# Altium project MIKSER_SIROVINE.PrjPcb (part 1 of 2)
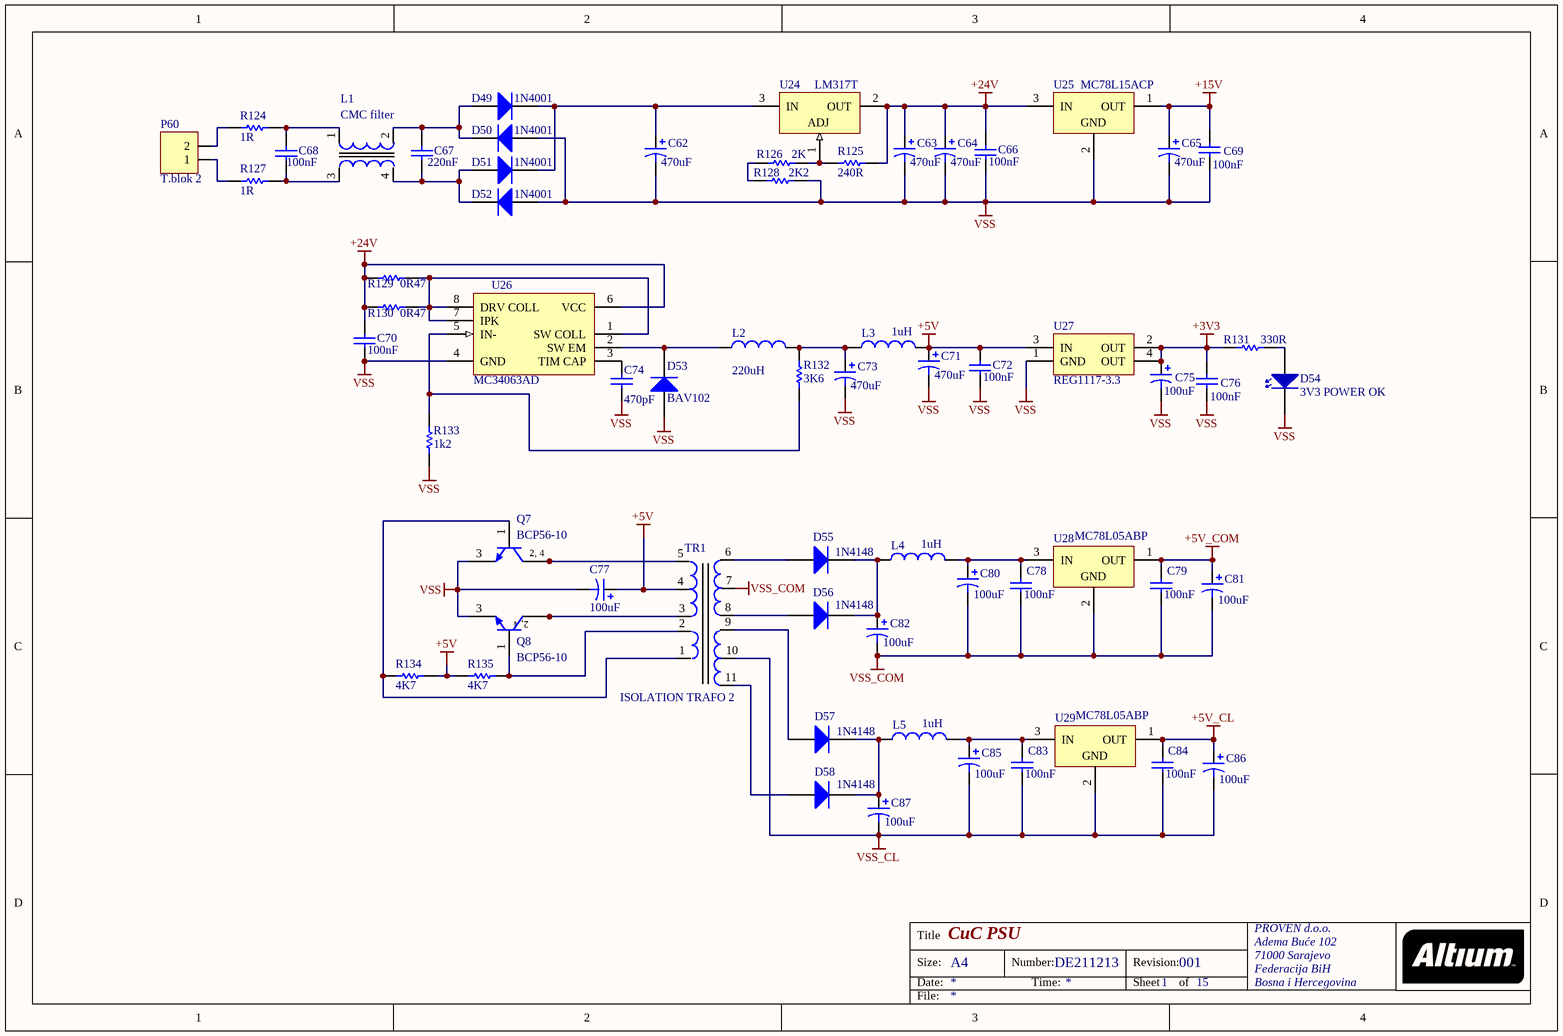
[diagram p0: CuC_PSU.SchDoc]
8 sheets, 430 parts. Net scope: global (net labels, ports and power ports of the same name join across sheets).
Board file: CuC_PCB.PcbDoc
Sheets:
  CuC_PSU.SchDoc
  CuC.SchDoc
  DigitalInput.SchDoc
  DigitalOutput.SchDoc
  RelayOutput.SchDoc
  AnalogOutput.SchDoc
  CuC_ControlComm.SchDoc
  CuC_DataComm.SchDoc

## Sheet CuC_PSU.SchDoc: CuC PSU
size A4; Author: eldar6776@hotmail.com; DrawnBy: Eldar Dedić; Organization: PROVEN d.o.o.; Address1: Adema Buće 102; Address2: 71000 Sarajevo; Address3: Federacija BiH; Address4: Bosna i Hercegovina; DocumentNumber: DE211213; Revision: 001; SheetNumber: 1; SheetTotal: 15; ProjectName: MIKSER SIROVINE

### Parts
C62  470uF  [CAPPR5-10X16]
C63  470uF  [CAPPR5-10X16]
C64  470uF  [CAPPR5-10X16]
C65  470uF  [CAPPR5-10X16]
C66  value 100nF  [1206]
C67  220nF  [VP60-3.6]
C68  100nF  [VP60-3.6]
C69  value 100nF  [1206]
C70  value 100nF  [1206]
C71  470uF  [CAPPR5-10X16]
C72  value 100nF  [1206]
C73  470uF  [CAPPR5-10X16]
C74  value 470pF  [0805]
C75  100uF  [CAPPR2-5X11]
C76  value 100nF  [1206]
C77  100uF  [CAPPR2-5X11]
C78  value 100nF  [1206]
C79  value 100nF  [1206]
C80  100uF  [CAPPR2-5X11]
C81  100uF  [CAPPR2-5X11]
C82  100uF  [CAPPR2-5X11]
C83  value 100nF  [1206]
C84  value 100nF  [1206]
C85  100uF  [CAPPR2-5X11]
C86  100uF  [CAPPR2-5X11]
C87  100uF  [CAPPR2-5X11]
D49  1N4001  [DO-41]
D50  1N4001  [DO-41]
D51  1N4001  [DO-41]
D52  1N4001  [DO-41]
D53  BAV102  [SOD80C]
D54  3V3 POWER OK  [LED 3mm]
D55  1N4148  [DO-35]
D56  1N4148  [DO-35]
D57  1N4148  [DO-35]
D58  1N4148  [DO-35]
L1  CMC filter  [MREZNI FILTER]
L2  value 220uH  [RB5-10.5]
L3  value 1uH  [RB5-10.5]
L4  value 1uH  [RB5-10.5]
L5  value 1uH  [RB5-10.5]
P60  T.blok 2  [TERMINAL BLOK 2]
Q7  BCP56-10  [SOT223_N]
Q8  BCP56-10  [SOT223_N]
R124  1R  [R6.35x2.3]
R125  240R  [ERA-0805]
R126  2K  [ERA-0805]
R127  1R  [R6.35x2.3]
R128  2K2  [ERA-0805]
R129  0R47  [RD6.35x2.3]
R130  0R47  [RD6.35x2.3]
R131  330R  [ERA-0603]
R132  3K6  [ERA-0805]
R133  1k2  [ERA-0805]
R134  4K7  [ERA-0805]
R135  4K7  [ERA-0805]
TR1  ISOLATION TRAFO 2  [ISOLATION TRAFO 2]
U24  LM317T  [221A-04]
U25  MC78L15ACP  [29-04]
U26  MC34063AD  [626-05]
U27  REG1117-3.3  [ZZ311]
U28  MC78L05ABP  [29-04]
U29  MC78L05ABP  [29-04]

### Nets
+3V3: C75.1 C76.2 R131.1 U27.2(OUT) U27.4(OUT)
+5V: C71.1 C72.2 C77.1 L3.2 R134.1 R135.2 TR1.4 U27.3(IN)
+5V_CL: C84.2 C86.1 U29.1(OUT)
+5V_COM: C79.2 C81.1 U28.1(OUT)
+15V: C65.1 C69.2 U25.1(OUT)
+24V: C63.1 C64.1 C66.2 C70.2 R125.1 R129.1 R130.1 U24.2(OUT) U25.3(IN) U26.6(VCC)
VSS: C62.2 C63.2 C64.2 C65.2 C66.1 C69.1 C70.1 C71.2 C72.1 C73.2 C74.1 C75.2 C76.1 C77.2 D50.1(A) D52.1(A) D53.1(A) D54.1 Q7.3(E) Q8.3(E) R128.1 R133.1 U25.2(GND) U26.4(GND) U27.1(GND)
VSS_CL: C83.1 C84.1 C85.2 C86.2 C87.2 TR1.10 U29.2(GND)
VSS_COM: C78.1 C79.1 C80.2 C81.2 C82.2 TR1.7 U28.2(GND)
NetC62_1: C62.1 D49.2(K) D51.2(K) U24.3(IN)
NetC67_1: C67.1 D51.1(A) D52.2(K) L1.4
NetC67_2: C67.2 D49.1(A) D50.2(K) L1.2
NetC68_1: C68.1 L1.3 R127.1
NetC68_2: C68.2 L1.1 R124.1
NetC73_1: C73.1 L2.2 L3.1 R132.2
NetC74_2: C74.2 U26.3(TIM_CAP)
NetC78_2: C78.2 C80.1 L4.2 U28.3(IN)
NetC82_1: C82.1 D55.2(K) D56.2(K) L4.1
NetC83_2: C83.2 C85.1 L5.2 U29.3(IN)
NetC87_1: C87.1 D57.2(K) D58.2(K) L5.1
NetD53_2: D53.2(K) L2.1 U26.2(SW_EM)
NetD54_2: D54.2 R131.2
NetD55_1: D55.1(A) TR1.6
NetD56_1: D56.1(A) TR1.8
NetD57_1: D57.1(A) TR1.9
NetD58_1: D58.1(A) TR1.11
NetP60_1: P60.1 R127.2
NetP60_2: P60.2 R124.2
NetQ7_1: Q7.1(B) R134.2 TR1.1
NetQ7_2: Q7.2(C) Q7.4(C) TR1.5
NetQ8_1: Q8.1(B) R135.1 TR1.2
NetQ8_2: Q8.2(C) Q8.4(C) TR1.3
NetR125_2: R125.2 R126.2 U24.1(ADJ)
NetR126_1: R126.1 R128.2
NetR129_2: R129.2 R130.2 U26.1(SW_COLL) U26.7(IPK) U26.8(DRV_COLL)
NetR132_1: R132.1 R133.2 U26.5(IN-)

### Notes on the sheet
- Title
- Size:
- Date:
- A4
- Number:
- Time:
- Revision:
- Sheet
- of
- File:
- (in symbol BCP56-10) 2, 4

### Library data of the parts
C62-C65 C71 C73 = EKA00DD347F00: Aluminum Electrolytic Capacitor, Radial Style with Long Leads: 470uF, 35V; Note: Refer to Manufacturer's Data Sheets for other lead formations; DrillSize: Nominal, Rounded To The Nearest 0.1mm; Published: 19-Mar-2004; DatasheetDocument: 20-Feb-2001; PackageReference: CAPPR5-10X16; Publisher: Altium Limited; ComponentLink1Description: Manufacturer Link; ComponentLink1URL: http://www.vishay.com/; ComponentLink2Description: Datasheet; ComponentLink2URL: http://www.vishay.com/docs/25014/eka.pdf; Value: 470uF
C66 C69 C70 C72 C76 C78 C79 C83 C84 = C1206: Ceramic Chip Capacitor - Standard; Published: 17-Jul-2002; LatestRevisionDate: 19-Mar-2004; LatestRevisionNote: Silkscreen size reduced.; DatasheetDocument: Mar-2001; PackageDocument: Mar-2001; PackageReference: 1206; Publisher: Altium Limited; Code_JEITA: 1206; Code_IPC: 3216 [1206]; ComponentLink1Description: Manufacturer Link; ComponentLink1URL: http://www.kemet.com/; ComponentLink2Description: Datasheet; ComponentLink2URL: http://www.kemet.com/kemet/web/homepage/kechome.nsf/vapubfilesname/F3102TA.pdf/$file/F3102TA.pdf
C67 C68 = VP60BA683KA: Dipped Radial Multilayer Ceramic Capacitor COG (NPO): 68nF, 50/63V; Published: 17-Dec-2003; LatestRevisionDate: 19-Mar-2004; LatestRevisionNote: PCB Footprint - Drill hole diameter reduced.; DatasheetDocument: 2-Jan-2002; PackageDocument: 2-Jan-2002; PackageReference: VP60-3.6; Publisher: Altium Limited; ComponentLink1Description: Manufacturer Link; ComponentLink1URL: http://www.vishay.com/; Value: 68nF
C74 = C0805: Ceramic Chip Capacitor - Standard; Note: Footprint corresponds to dimensions for bulk cassette packaging. This case size has tightened tolerances.; Published: 17-Jul-2002; LatestRevisionDate: 19-Mar-2004; LatestRevisionNote: Silkscreen size reduced.; DatasheetDocument: Mar-2001; PackageDocument: Mar-2001; PackageReference: 0805; Publisher: Altium Limited; Code_JEITA: 0805; Code_IPC: 2012[0805]; ComponentLink1Description: Manufacturer Link; ComponentLink1URL: http://www.kemet.com/; ComponentLink2Description: Datasheet; ComponentLink2URL: http://www.kemet.com/kemet/web/homepage/kechome.nsf/vapubfilesname/F3102TA.pdf/$file/F3102TA.pdf
C75 C77 C80-C82 C85-C87 = EKA00AA310D00: Aluminum Electrolytic Capacitor, Radial Style with Long Leads: 100uF, 16V; Note: Refer to Manufacturer's Data Sheets for other lead formations; DrillSize: Nominal, Rounded To The Nearest 0.1mm; Published: 19-Mar-2004; DatasheetDocument: 20-Feb-2001; PackageReference: CAPPR2-5X11; Publisher: Altium Limited; ComponentLink1Description: Manufacturer Link; ComponentLink1URL: http://www.vishay.com/; ComponentLink2Description: Datasheet; ComponentLink2URL: http://www.vishay.com/docs/25014/eka.pdf; Value: 100uF
D49-D52 = Diode 1N4007: 1 Amp General Purpose Rectifier; Published: 8-Jun-2000; LatestRevisionDate: 17-Jul-2002; LatestRevisionNote: Re-released for DXP Platform.; DatasheetVersion: 1998; PackageVersion: Aug-1999; PackageReference: DO-41; Publisher: Altium Limited; PackageDescription: Diode, Axial; Body 5.2 x 2.7 mm (LxDia. max), Lead Dia. 0.86 mm (max); Code_JEDEC: DO-204-AL; ComponentLink1Description: Manufacturer Link; ComponentLink1URL: http://www.fairchildsemi.com/; ComponentLink2Description: Datasheet; ComponentLink2URL: http://www.fairchildsemi.com/ds/1N%2F1N4001.pdf
D53 = BAV102: General-purpose Diode; Published: 17-Sep-2003; LatestRevisionDate: 19-Mar-2004; LatestRevisionNote: Silkscreen size reduced.; DatasheetVersion: 17-Sep-1996; PackageVersion: Jan-2002; PackageReference: SOD80C; Publisher: Altium Limited; PackageDescription: Metal Electrode Face (MELF) Diode; Body 3.5 x 1.6 mm (LxDia); ComponentLink1Description: Manufacturer Link; ComponentLink1URL: http://www.semiconductors.philips.com/; ComponentLink2Description: Datasheet; ComponentLink2URL: http://www.semiconductors.philips.com/acrobat/datasheets/BAV100_2.pdf
D54 = LED 3mm
D55-D58 = Diode 1N4148: High Conductance Fast Diode; Published: 8-Jun-2000; LatestRevisionDate: 17-Jul-2002; LatestRevisionNote: Re-released for DXP Platform.; DatasheetVersion: 1997; PackageReference: DO-35; Publisher: Altium Limited; PackageDescription: Diode, Axial; Body 3.8 x 1.9 mm (LxDia. max), Lead Dia. 0.53 mm (max); Code_JEDEC: DO-204-AH; ComponentLink1Description: Manufacturer Link; ComponentLink1URL: http://www.fairchildsemi.com/; ComponentLink2Description: Datasheet; ComponentLink2URL: http://www.fairchildsemi.com/ds/1N%2F1N4148.pdf
L1 = MREZNI FILTER
L2-L5 = PCMC063T-R82MN: SMT Power Choke Coil; Size 7.3×6.6×3.0mm, ±20% Tolerance, 0.82uH, 13A; PCB_Layout: Complies with manufacturer's recommendation.; Published: 26-Sep-2008; DatasheetVersion: Oct-2007; PackageVersion: Oct-2007; PackageReference: PCMC063T; Publisher: Altium Limited; PackageDescription: SM Power Choke Coil; 2 Leads; Body 7.3 x 6.6 x 3.0 mm (LxWxH); ComponentLink1Description: Manufacturer Link; ComponentLink1URL: http://www.susumu.co.jp/; ComponentLink2Description: Datasheet; ComponentLink2URL: http://www.susumu.co.jp/english/pdf/products-j07-01.pdf
P60 = TERMINAL BLOK 2: Terminal blok konektor 3,5 mm
Q7 Q8 = BCP56-10: NPN Medium Power Transistor; Published: 17-Sep-2003; LatestRevisionDate: 12-Dec-2006; LatestRevisionNote: IPC-7351 Footprint Added.; DatasheetVersion: 10-Oct-2001; PackageVersion: Aug-2001; PackageReference: SOT223; Publisher: Altium Limited; PackageDescription: 4-Pin SOT-223 Package 2.3 mm Pitch, 7 mm Lead Span; ComponentLink1Description: Manufacturer Link; ComponentLink1URL: http://www.semiconductors.philips.com/; ComponentLink2Description: Datasheet; ComponentLink2URL: http://www.semiconductors.philips.com/acrobat/datasheets/BC639_BCP56_BCX56_7.pdf
R124 R127 = ERG12: Metal Oxide Film Resistor, 0.1 Ohm to 47k Ohm Range, 2% and 5% Tolerance, 0.5 W; Published: 17-Dec-2003; PackageReference: R6.35x2.3; Publisher: Altium Limited; ComponentLink1Description: Manufacturer Link; ComponentLink1URL: http://www.panasonic.com/industrial/components/resistive_products.htm; ComponentLink2Description: Datasheet; ComponentLink2URL: http://www.panasonic.com/industrial/components/pdf/AOA0000CE18.pdf
R125 R126 R128 R132-R135 = ERAS: Metal Film Thermosensitive Chip Resistor, 0.56 Ohm to 10k Ohm Range, 5% Tolerance, 0805 Size, 0.1 W; Note: If flow soldering, adjust pad width of PCB Footprint to 0.7 - 0.8 times the width of the resistor.; Published: 17-Dec-2003; LatestRevisionDate: 19-Mar-2004; LatestRevisionNote: Silkscreen size reduced.; PackageDocument: Mar-2003; PackageReference: ERA-0805; Publisher: Altium Limited; Code_IPC: 2012 [0805]; ComponentLink1Description: Manufacturer Link; ComponentLink1URL: http://www.panasonic.com/industrial/components/resistive_products.htm; ComponentLink2Description: Datasheet; ComponentLink2URL: http://www.panasonic.com/industrial/components/pdf/AOF0000CE1.pdf
R129 R130 = ERDS1T: Carbon Film Resistor, 1 Ohm to 3.3M Ohm Range, 5% Tolerance, 0.5 W; Published: 17-Dec-2003; PackageReference: RD6.35x2.3; Publisher: Altium Limited; ComponentLink1Description: Manufacturer Link; ComponentLink1URL: http://www.panasonic.com/industrial/components/resistive_products.htm; ComponentLink2Description: Datasheet; ComponentLink2URL: http://www.panasonic.com/industrial/components/pdf/AOA0000CE12.pdf
R131 = ERA3Y: Rectangular Thick Film Chip Resistor, 10 Ohm to 330k Ohm Range, 0.1% and 0.5% Tolerance, 0603 Size, 0.063 W; Note: If flow soldering, adjust pad width of PCB Footprint to 0.7 - 0.8 times the width of the resistor.; Published: 17-Dec-2003; LatestRevisionDate: 19-Mar-2004; LatestRevisionNote: Silkscreen size reduced.; PackageDocument: Mar-2003; PackageReference: ERA-0603; Publisher: Altium Limited; Code_IPC: 1608 [0603]; ComponentLink1Description: Manufacturer Link; ComponentLink1URL: http://www.panasonic.com/industrial/components/resistive_products.htm; ComponentLink2Description: Datasheet; ComponentLink2URL: http://www.panasonic.com/industrial/components/pdf/AOA0000CE8.pdf
U24 = LM317T: 3-Terminal Adjustable Positive Voltage Regulator; Note: Heatsink surface connected to pin 2.; Published: 17-Jul-2002; DatasheetVersion: 1988; PackageReference: 221A-04; Publisher: Altium Limited; PackageDescription: TO, Thru-Hole, Vertical, Heatsink Mounted; 3 In-Line Leads; Pitch 2.54 mm; Code_JEDEC: TO-262-AA; ComponentLink1Description: Manufacturer Link; ComponentLink1URL: http://www.onsemi.com/site/products/taxonomy/0,4438,503,00.html; ComponentLink2Description: Datasheet; ComponentLink2URL: http://www.onsemi.com/pub/Collateral/LM317-D.PDF
U25 = MC78L15ACP: 3-Terminal Low-Current Positive Fixed Voltage Regulator; Published: 17-Jul-2002; DatasheetVersion: 1988; PackageVersion: 1996; PackageReference: 29-04; Publisher: Altium Limited; PackageDescription: TO, Flat Index; 3 In-Line, Axial Leads; Body Dia. 4.8mm; Leads 0.48 x 0.5 mm (max); ComponentLink1Description: Manufacturer Link; ComponentLink1URL: http://www.onsemi.com/site/products/taxonomy/0,4438,503,00.html; ComponentLink2Description: Datasheet; ComponentLink2URL: http://www.onsemi.com/pub/Collateral/MC78L00A-D.PDF
U26 = MC34063AD: DC-to-DC Converter Control Circuit; Published: 15-Apr-2002; LatestRevisionDate: 13-Apr-2006; LatestRevisionNote: IPC-7351 Footprint Added.; DatasheetVersion: 1996; PackageVersion: 1998; PackageReference: 751-05; Publisher: Altium Limited; PackageDescription: 8-Pin Small Outline Integrated Circuit 1.27 mm Pitch; Code_JEDEC: MS-012-AA; Code_IPC: SOIC127P600-8; ComponentLink1Description: Manufacturer Link; ComponentLink1URL: http://www.onsemi.com/site/products/taxonomy/0,4438,503,00.html; ComponentLink2Description: Datasheet; ComponentLink2URL: http://www.onsemi.com/pub/Collateral/MC34063A-D.PDF
U27 = REG1117-3.3: 800mA and 1A Low Dropout Positive Regulator 2.85V, 3.3V, 5V, and Adjustable; Published: 8-Jun-2000; LatestRevisionDate: 17-Jul-2002; LatestRevisionNote: Re-released for DXP Platform.; DatasheetVersion: Sep-1997; PackageVersion: revC; PackageReference: ZZ311; Publisher: Altium Limited; PackageDescription: SOT-223/SC-73; 4 Leads; Body 6.7 x 7.3 mm, inc. leads (LxW max); ComponentLink1Description: Manufacturer Link; ComponentLink1URL: http://www.ti.com/; ComponentLink2Description: Datasheet; ComponentLink2URL: http://www-s.ti.com/sc/ds/REG1117.pdf
U28 U29 = MC78L05ABP: 3-Terminal Low-Current Positive Fixed Voltage Regulator; Published: 17-Jul-2002; DatasheetVersion: 1988; PackageVersion: 1996; PackageReference: 29-04; Publisher: Altium Limited; PackageDescription: TO, Flat Index; 3 In-Line, Axial Leads; Body Dia. 4.8mm; Leads 0.48 x 0.5 mm (max); ComponentLink1Description: Manufacturer Link; ComponentLink1URL: http://www.onsemi.com/site/products/taxonomy/0,4438,503,00.html; ComponentLink2Description: Datasheet; ComponentLink2URL: http://www.onsemi.com/pub/Collateral/MC78L00A-D.PDF

## Sheet CuC.SchDoc: CuC
size A4; Author: eldar6776@hotmail.com; DrawnBy: Eldar Dedić; Organization: PROVEN d.o.o.; Address1: Adema Buće 102; Address2: 71000 Sarajevo; Address3: Federacija BiH; Address4: Bosna i Hercegovina; DocumentNumber: DE211213; Revision: 001; SheetNumber: 2; SheetTotal: 15; ProjectName: MIKSER SIROVINE
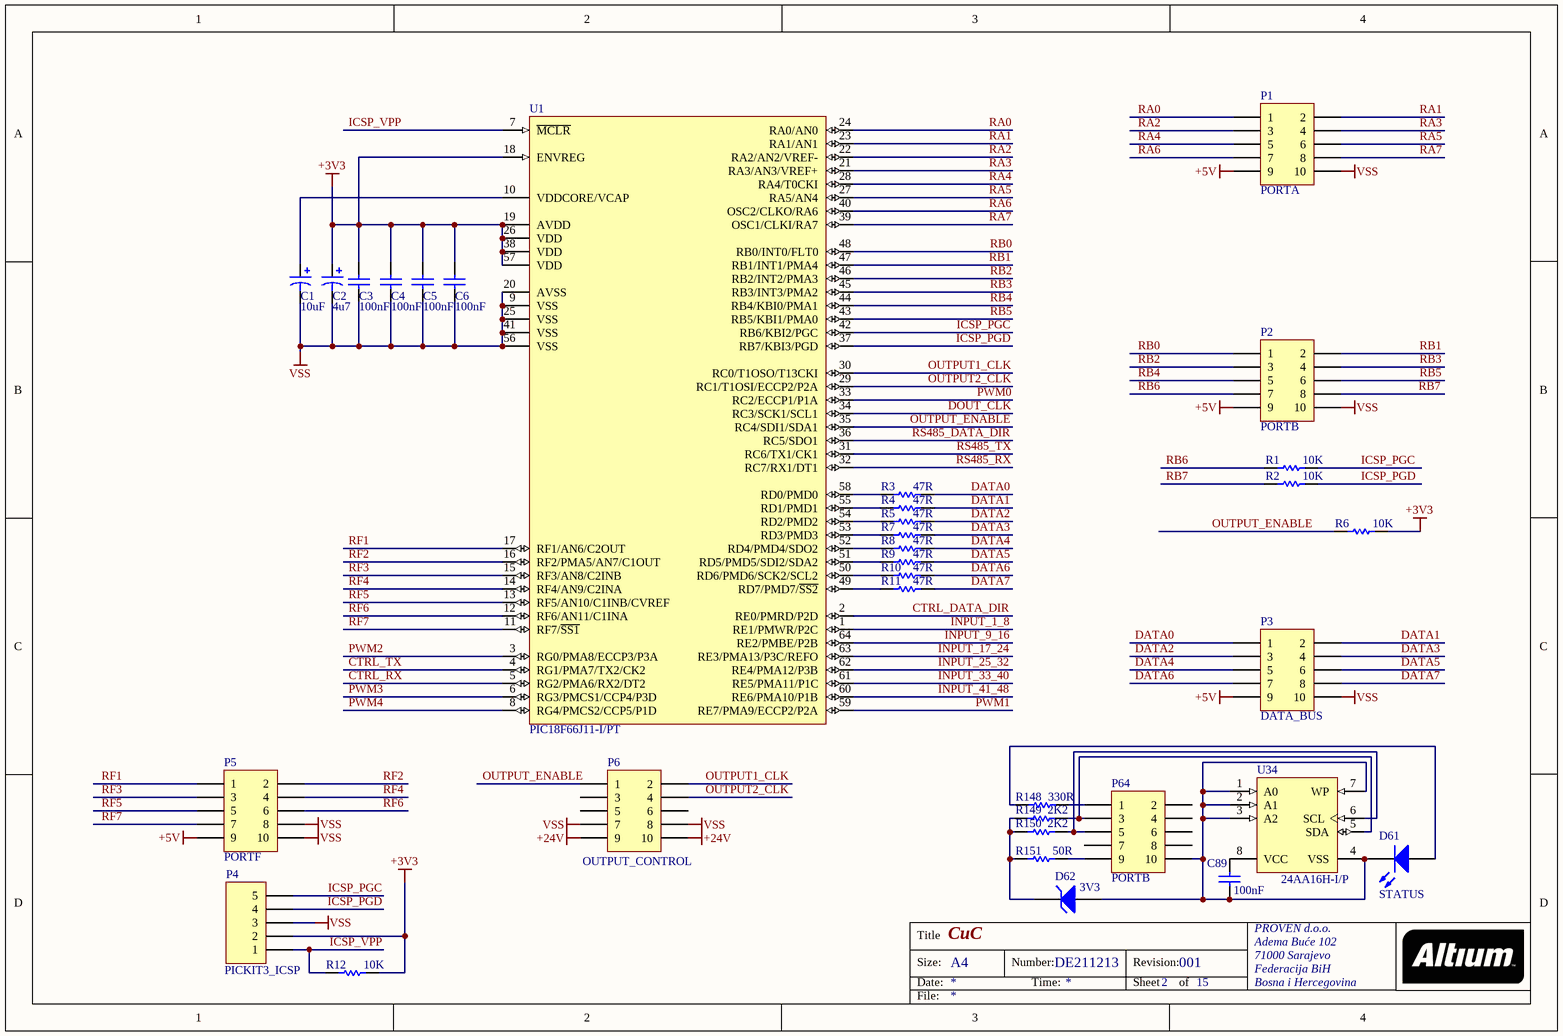
[diagram p1: CuC.SchDoc]

### Parts
C1  10uF  [CAPPR1.5-4X7]
C2  4u7  [CAPPR1.5-4X7]
C3  value 100nF  [1206]
C4  value 100nF  [1206]
C5  value 100nF  [1206]
C6  value 100nF  [1206]
C89  value 100nF  [1206]
D61  STATUS  [LED-0]
D62  3V3  [DIODE-0.7]
P1  PORTA  [HDR2X5]
P2  PORTB  [HDR2X5]
P3  DATA_BUS  [HDR2X5]
P4  PICKIT3_ICSP  [HDR1X5]
P5  PORTF  [HDR2X5]
P6  OUTPUT_CONTROL  [HDR2X5]
P64  PORTB  [HDR2X5]
R1  10K  [ERA-0603]
R2  10K  [ERA-0603]
R3  47R  [ERA-0603]
R4  47R  [ERA-0603]
R5  47R  [ERA-0603]
R6  10K  [ERA-0603]
R7  47R  [ERA-0603]
R8  47R  [ERA-0603]
R9  47R  [ERA-0603]
R10  47R  [ERA-0603]
R11  47R  [ERA-0603]
R12  10K  [ERA-0603]
R148  330R  [ERA-0603]
R149  2K2  [ERA-0603]
R150  2K2  [ERA-0603]
R151  50R  [ERA-0603]
U1  PIC18F66J11-I/PT  [TQFP-PT64_N]
U34  24AA16H-I/P  [PDIP300-P8]

### Nets
+3V3: C2.1 C3.1 C4.1 C5.1 C6.1 P4.2 R6.2 R12.2 U1.18(ENVREG) U1.19(AVDD) U1.26(VDD) U1.38(VDD) U1.57(VDD)
+5V: P1.9 P2.9 P3.9 P5.9
+24V: P6.9 P6.10
VSS: C1.2 C2.2 C3.2 C4.2 C5.2 C6.2 P1.10 P2.10 P3.10 P4.3 P5.8 P5.10 P6.7 P6.8 U1.9(VSS) U1.20(AVSS) U1.25(VSS) U1.41(VSS) U1.56(VSS)
CTRL_DATA_DIR: U1.2(RE0/PMRD/P2D)
CTRL_RX: U1.5(RG2/PMA6/RX2/DT2)
CTRL_TX: U1.4(RG1/PMA7/TX2/CK2)
DATA0: P3.1 R3.2
DATA1: P3.2 R4.2
DATA2: P3.3 R5.2
DATA3: P3.4 R7.2
DATA4: P3.5 R8.2
DATA5: P3.6 R9.2
DATA6: P3.7 R10.2
DATA7: P3.8 R11.2
DOUT_CLK: U1.34(RC3/SCK1/SCL1)
ICSP_PGC: P4.5 R1.2 U1.42(RB6/KBI2/PGC)
ICSP_PGD: P4.4 R2.2 U1.37(RB7/KBI3/PGD)
ICSP_VPP: P4.1 R12.1 U1.7(~{MCLR})
INPUT_1_8: U1.1(RE1/PMWR/P2C)
INPUT_9_16: U1.64(RE2/PMBE/P2B)
INPUT_17_24: U1.63(RE3/PMA13/P3C/REFO)
INPUT_25_32: U1.62(RE4/PMA12/P3B)
INPUT_33_40: U1.61(RE5/PMA11/P1C)
INPUT_41_48: U1.60(RE6/PMA10/P1B)
OUTPUT1_CLK: P6.2 U1.30(RC0/T1OSO/T13CKI)
OUTPUT2_CLK: P6.4 U1.29(RC1/T1OSI/ECCP2/P2A)
OUTPUT_ENABLE: P6.1 R6.1 U1.35(RC4/SDI1/SDA1)
PWM0: U1.33(RC2/ECCP1/P1A)
PWM1: U1.59(RE7/PMA9/ECCP2/P2A)
PWM2: U1.3(RG0/PMA8/ECCP3/P3A)
PWM3: U1.6(RG3/PMCS1/CCP4/P3D)
PWM4: U1.8(RG4/PMCS2/CCP5/P1D)
RA0: P1.1 U1.24(RA0/AN0)
RA1: P1.2 U1.23(RA1/AN1)
RA2: P1.3 U1.22(RA2/AN2/VREF-)
RA3: P1.4 U1.21(RA3/AN3/VREF+)
RA4: P1.5 U1.28(RA4/T0CKI)
RA5: P1.6 U1.27(RA5/AN4)
RA6: P1.7 U1.40(OSC2/CLKO/RA6)
RA7: P1.8 U1.39(OSC1/CLKI/RA7)
RB0: P2.1 U1.48(RB0/INT0/FLT0)
RB1: P2.2 U1.47(RB1/INT1/PMA4)
RB2: P2.3 U1.46(RB2/INT2/PMA3)
RB3: P2.4 U1.45(RB3/INT3/PMA2)
RB4: P2.5 U1.44(RB4/KBI0/PMA1)
RB5: P2.6 U1.43(RB5/KBI1/PMA0)
RB6: P2.7 R1.1
RB7: P2.8 R2.1
RF1: P5.1 U1.17(RF1/AN6/C2OUT)
RF2: P5.2 U1.16(RF2/PMA5/AN7/C1OUT)
RF3: P5.3 U1.15(RF3/AN8/C2INB)
RF4: P5.4 U1.14(RF4/AN9/C2INA)
RF5: P5.5 U1.13(RF5/AN10/C1INB/CVREF)
RF6: P5.6 U1.12(RF6/AN11/C1INA)
RF7: P5.7 U1.11(RF7/~{SS1})
RS485_DATA_DIR: U1.36(RC5/SDO1)
RS485_RX: U1.32(RC7/RX1/DT1)
RS485_TX: U1.31(RC6/TX1/CK1)
NetC1_1: C1.1 U1.10(VDDCORE/VCAP)
NetC89_1: C89.1 D61.2(K) D62.1(A) P64.10 U34.1(A0) U34.2(A1) U34.3(A2) U34.4(VSS) U34.7(WP)
NetC89_2: C89.2 U34.8(VCC)
NetD61_1: D61.1(A) R148.2
NetD62_2: D62.2(K) R149.1 R150.1 R151.1
NetP64_1: P64.1 R148.1
NetP64_3: P64.3 R149.2 U34.5(SDA)
NetP64_5: P64.5 R150.2 U34.6(SCL)
NetP64_9: P64.9 R151.2
NetR3_1: R3.1 U1.58(RD0/PMD0)
NetR4_1: R4.1 U1.55(RD1/PMD1)
NetR5_1: R5.1 U1.54(RD2/PMD2)
NetR7_1: R7.1 U1.53(RD3/PMD3)
NetR8_1: R8.1 U1.52(RD4/PMD4/SDO2)
NetR9_1: R9.1 U1.51(RD5/PMD5/SDI2/SDA2)
NetR10_1: R10.1 U1.50(RD6/PMD6/SCK2/SCL2)
NetR11_1: R11.1 U1.49(RD7/PMD7/~{SS2})

Not connected (* = marked no-connect by the designer): P6 3 5 6; P64 2 4 6 7 8

### Notes on the sheet
- Title
- Size:
- Date:
- A4
- Number:
- Time:
- Revision:
- Sheet
- of
- File:

### Library data of the parts
C1 C2 = EKF00MM147J00: Aluminum Electrolytic Capacitor, Radial Style with Long Leads: 4.7uF, 63V; Note: Refer to Manufacturer's Data Sheets for other lead formations; DrillSize: Nominal, Rounded To The Nearest 0.05mm; Published: 19-Mar-2004; DatasheetDocument: 13-Jan-2000; PackageReference: CAPPR1.5-4X7; Publisher: Altium Limited; ComponentLink1Description: Manufacturer Link; ComponentLink1URL: http://www.vishay.com/; ComponentLink2Description: Datasheet; ComponentLink2URL: http://www.vishay.com/docs/25004/ekf.pdf; Value: 4.7uF
C3-C6 C89 = C1206: Ceramic Chip Capacitor - Standard; Published: 17-Jul-2002; LatestRevisionDate: 19-Mar-2004; LatestRevisionNote: Silkscreen size reduced.; DatasheetDocument: Mar-2001; PackageDocument: Mar-2001; PackageReference: 1206; Publisher: Altium Limited; Code_JEITA: 1206; Code_IPC: 3216 [1206]; ComponentLink1Description: Manufacturer Link; ComponentLink1URL: http://www.kemet.com/; ComponentLink2Description: Datasheet; ComponentLink2URL: http://www.kemet.com/kemet/web/homepage/kechome.nsf/vapubfilesname/F3102TA.pdf/$file/F3102TA.pdf
D61 = LED0: Typical INFRARED GaAs LED; Published: 8-Jun-2000; LatestRevisionDate: 08-Jul-2005; LatestRevisionNote: Mech Layer 1 removed.; PackageReference: LED-0; Publisher: Altium Limited; PackageDescription: LED; 2 Leads
D62 = D Zener: Zener Diode; Published: 8-Jun-2000; LatestRevisionDate: 17-Jul-2002; LatestRevisionNote: Re-released for DXP Platform.; PackageReference: DIODE-0.7; Publisher: Altium Limited; PackageDescription: Diode, Thru-Hole; 2 Leads; 0.7 in Pin Spacing
P1-P3 P5 P6 P64 = Header 5X2: Header, 5-Pin, Dual row; LatestRevisionDate: 17-Jul-2002; LatestRevisionNote: Re-released for DXP Platform.; Publisher: Altium Limited
P4 = Header 5: Header, 5-Pin; LatestRevisionDate: 17-Jul-2002; LatestRevisionNote: Re-released for DXP Platform.; Publisher: Altium Limited
R1-R12 R148-R151 = ERA3Y: as R131 on sheet CuC_PSU; Published: 17-Dec-2003; LatestRevisionDate: 19-Mar-2004; LatestRevisionNote: Silkscreen size reduced.; PackageDocument: Mar-2003; PackageReference: ERA-0603; Publisher: Altium Limited; Code_IPC: 1608 [0603]; ComponentLink1Description: Manufacturer Link; ComponentLink1URL: http://www.panasonic.com/industrial/components/resistive_products.htm; ComponentLink2Description: Datasheet; ComponentLink2URL: http://www.panasonic.com/industrial/components/pdf/AOA0000CE8.pdf
U1 = PIC18F66J11-I/PT: High Performance, 1-Mbit Flash Microcontroller with nanoWatt Technology, 64K Flash, 64-Pin TQFP, Industrial Temperature Range; Published: 29-Jan-2009; LatestRevisionDate: 02-Dec-2009; LatestRevisionNote: Updated to datasheet revision D, Oct-2009; DatasheetVersion: revD, Oct-2009; PackageVersion: revBB, Aug-2009; PackageReference: TQFP-PT64; Publisher: Altium Limited; PackageDescription: 64-Lead Thin Plastic Quad Flat Pack (PT) - 10x10x1mm Body, 2.00mm [TQFP]; Supplier 1: Digi-Key; Supplier Part Number 1: PIC18F66J11-I/PT-ND; Code_JEDEC: MS-026; ComponentLink1Description: Datasheet; ComponentLink1URL: http://ww1.microchip.com/downloads/en/DeviceDoc/39778d.pdf; ComponentLink2Description: Packaging Specification; ComponentLink2URL: http://www.microchip.com/stellent/groups/techpub_sg/documents/packagingspec/en012702.pdf; ComponentLink3Description: Microchip.com Home; ComponentLink3URL: http://www.microchip.com/
U34 = 24AA16H-I/P: 16Kbit, 400kHz, 1.7V, I2C Serial EEPROM, 8-Pin PDIP, Industrial Temperature; Published: 2-Dec-2009; DatasheetVersion: revA, Nov-2008; PackageVersion: revBB, Aug-2009; PackageReference: PDIP300-P8; Publisher: Altium Limited; PackageDescription: 8-Lead Plastic Dual In-Line (P) - 300 mil Body [PDIP]; Supplier 1: Digi-Key; Supplier Part Number 1: 24AA16H-I/P-ND; Code_JEDEC: MS-001; ComponentLink1Description: Datasheet; ComponentLink1URL: http://ww1.microchip.com/downloads/en/DeviceDoc/22118A.pdf; ComponentLink2Description: Packaging Specification; ComponentLink2URL: http://www.microchip.com/stellent/groups/techpub_sg/documents/packagingspec/en012702.pdf; ComponentLink3Description: Microchip.com Home; ComponentLink3URL: http://www.microchip.com/

## Sheet DigitalInput.SchDoc: Digital input
size A3; Author: eldar6776@hotmail.com; DrawnBy: Eldar Dediæ; Organization: PROVEN d.o.o.; Address1: Adema Buæe 102; Address2: 71000 Sarajevo; Address3: Federacija BiH; Address4: Bosna i Hercegovina; DocumentNumber: DE211213; Revision: 001; SheetNumber: 3; SheetTotal: 15; ProjectName: MIKSER SIROVINE
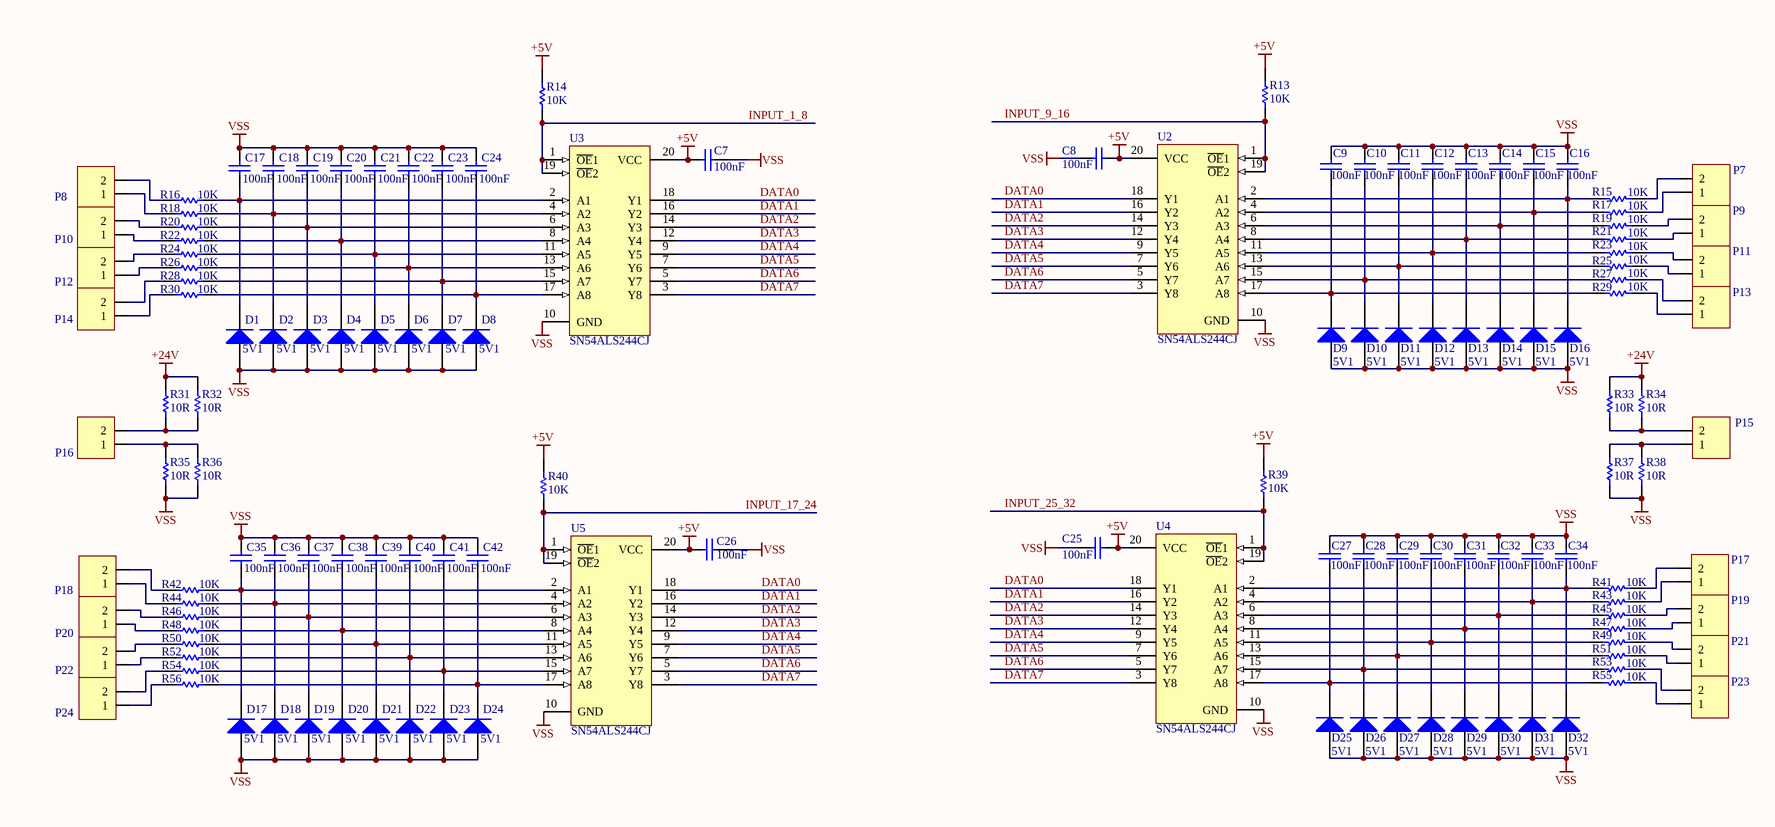
[diagram p2: DigitalInput.SchDoc]

### Parts
C7  value 100nF  [1206]
C8  value 100nF  [1206]
C9  value 100nF  [1206]
C10  value 100nF  [1206]
C11  value 100nF  [1206]
C12  value 100nF  [1206]
C13  value 100nF  [1206]
C14  value 100nF  [1206]
C15  value 100nF  [1206]
C16  value 100nF  [1206]
C17  value 100nF  [1206]
C18  value 100nF  [1206]
C19  value 100nF  [1206]
C20  value 100nF  [1206]
C21  value 100nF  [1206]
C22  value 100nF  [1206]
C23  value 100nF  [1206]
C24  value 100nF  [1206]
C25  value 100nF  [1206]
C26  value 100nF  [1206]
C27  value 100nF  [1206]
C28  value 100nF  [1206]
C29  value 100nF  [1206]
C30  value 100nF  [1206]
C31  value 100nF  [1206]
C32  value 100nF  [1206]
C33  value 100nF  [1206]
C34  value 100nF  [1206]
C35  value 100nF  [1206]
C36  value 100nF  [1206]
C37  value 100nF  [1206]
C38  value 100nF  [1206]
C39  value 100nF  [1206]
C40  value 100nF  [1206]
C41  value 100nF  [1206]
C42  value 100nF  [1206]
D1  5V1  [SOD80C]
D2  5V1  [SOD80C]
D3  5V1  [SOD80C]
D4  5V1  [SOD80C]
D5  5V1  [SOD80C]
D6  5V1  [SOD80C]
D7  5V1  [SOD80C]
D8  5V1  [SOD80C]
D9  5V1  [SOD80C]
D10  5V1  [SOD80C]
D11  5V1  [SOD80C]
D12  5V1  [SOD80C]
D13  5V1  [SOD80C]
D14  5V1  [SOD80C]
D15  5V1  [SOD80C]
D16  5V1  [SOD80C]
D17  5V1  [SOD80C]
D18  5V1  [SOD80C]
D19  5V1  [SOD80C]
D20  5V1  [SOD80C]
D21  5V1  [SOD80C]
D22  5V1  [SOD80C]
D23  5V1  [SOD80C]
D24  5V1  [SOD80C]
D25  5V1  [SOD80C]
D26  5V1  [SOD80C]
D27  5V1  [SOD80C]
D28  5V1  [SOD80C]
D29  5V1  [SOD80C]
D30  5V1  [SOD80C]
D31  5V1  [SOD80C]
D32  5V1  [SOD80C]
P7  (no value)  [TERMINAL BLOK 2]
P8  (no value)  [TERMINAL BLOK 2]
P9  (no value)  [TERMINAL BLOK 2]
P10  (no value)  [TERMINAL BLOK 2]
P11  (no value)  [TERMINAL BLOK 2]
P12  (no value)  [TERMINAL BLOK 2]
P13  (no value)  [TERMINAL BLOK 2]
P14  (no value)  [TERMINAL BLOK 2]
P15  (no value)  [TERMINAL BLOK 2]
P16  (no value)  [TERMINAL BLOK 2]
P17  (no value)  [TERMINAL BLOK 2]
P18  (no value)  [TERMINAL BLOK 2]
P19  (no value)  [TERMINAL BLOK 2]
P20  (no value)  [TERMINAL BLOK 2]
P21  (no value)  [TERMINAL BLOK 2]
P22  (no value)  [TERMINAL BLOK 2]
P23  (no value)  [TERMINAL BLOK 2]
P24  (no value)  [TERMINAL BLOK 2]
R13  10K  [ERA-0805]
R14  10K  [ERA-0805]
R15  10K  [ERA-0805]
R16  10K  [ERA-0805]
R17  10K  [ERA-0805]
R18  10K  [ERA-0805]
R19  10K  [ERA-0805]
R20  10K  [ERA-0805]
R21  10K  [ERA-0805]
R22  10K  [ERA-0805]
R23  10K  [ERA-0805]
R24  10K  [ERA-0805]
R25  10K  [ERA-0805]
R26  10K  [ERA-0805]
R27  10K  [ERA-0805]
R28  10K  [ERA-0805]
R29  10K  [ERA-0805]
R30  10K  [ERA-0805]
R31  10R  [ERA-0603]
R32  10R  [ERA-0603]
R33  10R  [ERA-0603]
R34  10R  [ERA-0603]
R35  10R  [ERA-0603]
R36  10R  [ERA-0603]
R37  10R  [ERA-0603]
R38  10R  [ERA-0603]
R39  10K  [ERA-0805]
R40  10K  [ERA-0805]
R41  10K  [ERA-0805]
R42  10K  [ERA-0805]
R43  10K  [ERA-0805]
R44  10K  [ERA-0805]
R45  10K  [ERA-0805]
R46  10K  [ERA-0805]
R47  10K  [ERA-0805]
R48  10K  [ERA-0805]
R49  10K  [ERA-0805]
R50  10K  [ERA-0805]
R51  10K  [ERA-0805]
R52  10K  [ERA-0805]
R53  10K  [ERA-0805]
R54  10K  [ERA-0805]
R55  10K  [ERA-0805]
R56  10K  [ERA-0805]
U2  SN54ALS244CJ  [J020]
U3  SN54ALS244CJ  [J020]
U4  SN54ALS244CJ  [J020]
U5  SN54ALS244CJ  [J020]

### Nets
+5V: C7.1 C8.1 C25.1 C26.1 R13.2 R14.2 R39.2 R40.2 U2.20(VCC) U3.20(VCC) U4.20(VCC) U5.20(VCC)
+24V: R31.2 R32.2 R33.2 R34.2
VSS: C7.2 C8.2 C9.2 C10.2 C11.2 C12.2 C13.2 C14.2 C15.2 C16.2 C17.2 C18.2 C19.2 C20.2 C21.2 C22.2 C23.2 C24.2 C25.2 C26.2 C27.2 C28.2 C29.2 C30.2 C31.2 C32.2 C33.2 C34.2 C35.2 C36.2 C37.2 C38.2 C39.2 C40.2 C41.2 C42.2 D1.1(A) D2.1(A) D3.1(A) D4.1(A) D5.1(A) D6.1(A) D7.1(A) D8.1(A) D9.1(A) D10.1(A) D11.1(A) D12.1(A) D13.1(A) D14.1(A) D15.1(A) D16.1(A) D17.1(A) D18.1(A) D19.1(A) D20.1(A) D21.1(A) D22.1(A) D23.1(A) D24.1(A) D25.1(A) D26.1(A) D27.1(A) D28.1(A) D29.1(A) D30.1(A) D31.1(A) D32.1(A) R35.1 R36.1 R37.1 R38.1 U2.10(GND) U3.10(GND) U4.10(GND) U5.10(GND)
DATA0: U2.18(Y1) U3.18(Y1) U4.18(Y1) U5.18(Y1)
DATA1: U2.16(Y2) U3.16(Y2) U4.16(Y2) U5.16(Y2)
DATA2: U2.14(Y3) U3.14(Y3) U4.14(Y3) U5.14(Y3)
DATA3: U2.12(Y4) U3.12(Y4) U4.12(Y4) U5.12(Y4)
DATA4: U2.9(Y5) U3.9(Y5) U4.9(Y5) U5.9(Y5)
DATA5: U2.7(Y6) U3.7(Y6) U4.7(Y6) U5.7(Y6)
DATA6: U2.5(Y7) U3.5(Y7) U4.5(Y7) U5.5(Y7)
DATA7: U2.3(Y8) U3.3(Y8) U4.3(Y8) U5.3(Y8)
INPUT_1_8: R14.1 U3.1(~{OE}1) U3.19(~{OE}2)
INPUT_9_16: R13.1 U2.1(~{OE}1) U2.19(~{OE}2)
INPUT_17_24: R40.1 U5.1(~{OE}1) U5.19(~{OE}2)
INPUT_25_32: R39.1 U4.1(~{OE}1) U4.19(~{OE}2)
NetC9_1: C9.1 D9.2(K) R29.2 U2.17(A8)
NetC10_1: C10.1 D10.2(K) R27.2 U2.15(A7)
NetC11_1: C11.1 D11.2(K) R25.2 U2.13(A6)
NetC12_1: C12.1 D12.2(K) R23.2 U2.11(A5)
NetC13_1: C13.1 D13.2(K) R21.2 U2.8(A4)
NetC14_1: C14.1 D14.2(K) R19.2 U2.6(A3)
NetC15_1: C15.1 D15.2(K) R17.2 U2.4(A2)
NetC16_1: C16.1 D16.2(K) R15.2 U2.2(A1)
NetC17_1: C17.1 D1.2(K) R16.2 U3.2(A1)
NetC18_1: C18.1 D2.2(K) R18.2 U3.4(A2)
NetC19_1: C19.1 D3.2(K) R20.2 U3.6(A3)
NetC20_1: C20.1 D4.2(K) R22.2 U3.8(A4)
NetC21_1: C21.1 D5.2(K) R24.2 U3.11(A5)
NetC22_1: C22.1 D6.2(K) R26.2 U3.13(A6)
NetC23_1: C23.1 D7.2(K) R28.2 U3.15(A7)
NetC24_1: C24.1 D8.2(K) R30.2 U3.17(A8)
NetC27_1: C27.1 D25.2(K) R55.2 U4.17(A8)
NetC28_1: C28.1 D26.2(K) R53.2 U4.15(A7)
NetC29_1: C29.1 D27.2(K) R51.2 U4.13(A6)
NetC30_1: C30.1 D28.2(K) R49.2 U4.11(A5)
NetC31_1: C31.1 D29.2(K) R47.2 U4.8(A4)
NetC32_1: C32.1 D30.2(K) R45.2 U4.6(A3)
NetC33_1: C33.1 D31.2(K) R43.2 U4.4(A2)
NetC34_1: C34.1 D32.2(K) R41.2 U4.2(A1)
NetC35_1: C35.1 D17.2(K) R42.2 U5.2(A1)
NetC36_1: C36.1 D18.2(K) R44.2 U5.4(A2)
NetC37_1: C37.1 D19.2(K) R46.2 U5.6(A3)
NetC38_1: C38.1 D20.2(K) R48.2 U5.8(A4)
NetC39_1: C39.1 D21.2(K) R50.2 U5.11(A5)
NetC40_1: C40.1 D22.2(K) R52.2 U5.13(A6)
NetC41_1: C41.1 D23.2(K) R54.2 U5.15(A7)
NetC42_1: C42.1 D24.2(K) R56.2 U5.17(A8)
NetP7_1: P7.1 R17.1
NetP7_2: P7.2 R15.1
NetP8_1: P8.1 R18.1
NetP8_2: P8.2 R16.1
NetP9_1: P9.1 R21.1
NetP9_2: P9.2 R19.1
NetP10_1: P10.1 R22.1
NetP10_2: P10.2 R20.1
NetP11_1: P11.1 R25.1
NetP11_2: P11.2 R23.1
NetP12_1: P12.1 R26.1
NetP12_2: P12.2 R24.1
NetP13_1: P13.1 R29.1
NetP13_2: P13.2 R27.1
NetP14_1: P14.1 R30.1
NetP14_2: P14.2 R28.1
NetP15_1: P15.1 R37.2 R38.2
NetP15_2: P15.2 R33.1 R34.1
NetP16_1: P16.1 R35.2 R36.2
NetP16_2: P16.2 R31.1 R32.1
NetP17_1: P17.1 R43.1
NetP17_2: P17.2 R41.1
NetP18_1: P18.1 R44.1
NetP18_2: P18.2 R42.1
NetP19_1: P19.1 R47.1
NetP19_2: P19.2 R45.1
NetP20_1: P20.1 R48.1
NetP20_2: P20.2 R46.1
NetP21_1: P21.1 R51.1
NetP21_2: P21.2 R49.1
NetP22_1: P22.1 R52.1
NetP22_2: P22.2 R50.1
NetP23_1: P23.1 R55.1
NetP23_2: P23.2 R53.1
NetP24_1: P24.1 R56.1
NetP24_2: P24.2 R54.1

### Notes on the sheet
- Title
- Size:
- Date:
- A3
- Number:
- Time:
- Revision:
- Sheet
- of
- File:

### Library data of the parts
C7-C42 = C1206: Ceramic Chip Capacitor - Standard; Published: 17-Jul-2002; LatestRevisionDate: 19-Mar-2004; LatestRevisionNote: Silkscreen size reduced.; DatasheetDocument: Mar-2001; PackageDocument: Mar-2001; PackageReference: 1206; Publisher: Altium Limited; Code_JEITA: 1206; Code_IPC: 3216 [1206]; ComponentLink1Description: Manufacturer Link; ComponentLink1URL: http://www.kemet.com/; ComponentLink2Description: Datasheet; ComponentLink2URL: http://www.kemet.com/kemet/web/homepage/kechome.nsf/vapubfilesname/F3102TA.pdf/$file/F3102TA.pdf
D1-D32 = BZV85-C5V1: Voltage Regulator Diode; Published: 17-Sep-2003; DatasheetVersion: 11-May-1999; PackageVersion: May-1999; PackageReference: SOD66; Publisher: Altium Limited; PackageDescription: Diode, Axial; Body 4.8 x 2.6 mm (LxDia. max), Lead Dia. 0.81 mm (max); Code_JEDEC: DO-204-AL; ComponentLink1Description: Manufacturer Link; ComponentLink1URL: http://www.semiconductors.philips.com/; ComponentLink2Description: Datasheet; ComponentLink2URL: http://www.semiconductors.philips.com/acrobat/datasheets/BZV85_2.pdf
P7-P24 = Terminal blok 2 pina: Terminal blok 2
R13-R30 R39-R56 = ERA6Y: Rectangular Thick Film Chip Resistor, 10 Ohm to 1M Ohm Range, 0.1% and 0.5% Tolerance, 0805 Size, 0.1 W; Note: If flow soldering, adjust pad width of PCB Footprint to 0.7 - 0.8 times the width of the resistor.; Published: 17-Dec-2003; LatestRevisionDate: 19-Mar-2004; LatestRevisionNote: Silkscreen size reduced.; PackageDocument: Mar-2003; PackageReference: ERA-0805; Publisher: Altium Limited; Code_IPC: 2012 [0805]; ComponentLink1Description: Manufacturer Link; ComponentLink1URL: http://www.panasonic.com/industrial/components/resistive_products.htm; ComponentLink2Description: Datasheet; ComponentLink2URL: http://www.panasonic.com/industrial/components/pdf/AOA0000CE8.pdf
R31-R38 = ERA3Y: as R131 on sheet CuC_PSU; Published: 17-Dec-2003; LatestRevisionDate: 19-Mar-2004; LatestRevisionNote: Silkscreen size reduced.; PackageDocument: Mar-2003; PackageReference: ERA-0603; Publisher: Altium Limited; Code_IPC: 1608 [0603]; ComponentLink1Description: Manufacturer Link; ComponentLink1URL: http://www.panasonic.com/industrial/components/resistive_products.htm; ComponentLink2Description: Datasheet; ComponentLink2URL: http://www.panasonic.com/industrial/components/pdf/AOA0000CE8.pdf
U2-U5 = SN54ALS244CJ: Octal Buffer/Driver with 3-State Outputs; Published: 8-Jun-2000; LatestRevisionDate: 06-Jun-2005; LatestRevisionNote: Stylized 3D Model Added.; DatasheetVersion: Aug-1995; PackageVersion: Jun-1999; PackageReference: J020; Publisher: Altium Limited; PackageDescription: DIP; 20 Leads; Row Spacing 7.62 mm; Pitch 2.54 mm; ComponentLink1Description: Manufacturer Link; ComponentLink1URL: http://www.ti.com/; ComponentLink2Description: Datasheet; ComponentLink2URL: http://www-s.ti.com/sc/ds/sn74als244c.pdf

## Sheet DigitalOutput.SchDoc: Digital output
size A4; Author: eldar6776@hotmail.com; DrawnBy: Eldar Dediæ; Organization: PROVEN d.o.o.; Address1: Adema Buæe 102; Address2: 71000 Sarajevo; Address3: Federacija BiH; Address4: Bosna i Hercegovina; DocumentNumber: DE211213; Revision: 001; SheetNumber: 4; SheetTotal: 15; ProjectName: MIKSER SIROVINE
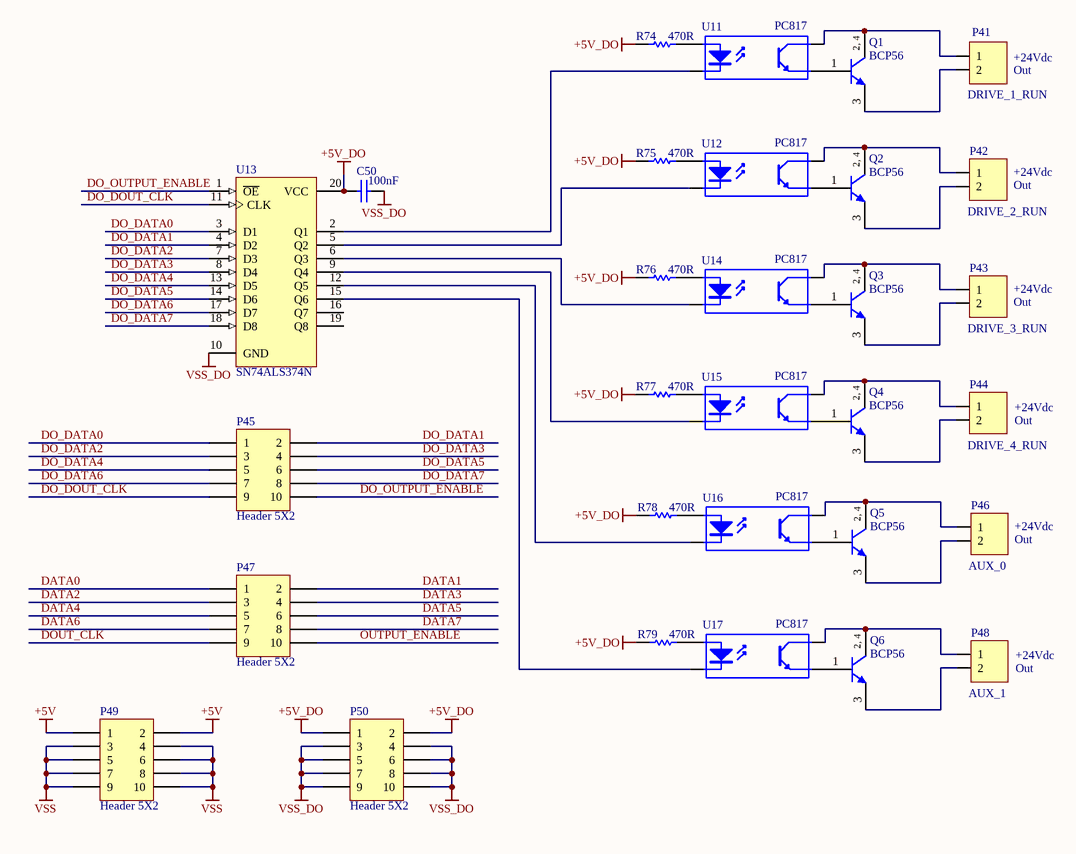
[diagram p3: DigitalOutput.SchDoc]

### Parts
C50  value 100nF  [1206]
P41  DRIVE_1_RUN  [TERMINAL BLOK 2]
P42  DRIVE_2_RUN  [TERMINAL BLOK 2]
P43  DRIVE_3_RUN  [TERMINAL BLOK 2]
P44  DRIVE_4_RUN  [TERMINAL BLOK 2]
P45  Header 5X2  [HDR2X5]
P46  AUX_0  [TERMINAL BLOK 2]
P47  Header 5X2  [HDR2X5]
P48  AUX_1  [TERMINAL BLOK 2]
P49  Header 5X2  [HDR2X5]
P50  Header 5X2  [HDR2X5]
Q1  BCP56  [SOT223_N]
Q2  BCP56  [SOT223_N]
Q3  BCP56  [SOT223_N]
Q4  BCP56  [SOT223_N]
Q5  BCP56  [SOT223_N]
Q6  BCP56  [SOT223_N]
R74  470R  [ERA-0805]
R75  470R  [ERA-0805]
R76  470R  [ERA-0805]
R77  470R  [ERA-0805]
R78  470R  [ERA-0805]
R79  470R  [ERA-0805]
U11  PC817  [DIP-4]
U12  PC817  [DIP-4]
U13  SN74ALS374N  [N020D]
U14  PC817  [DIP-4]
U15  PC817  [DIP-4]
U16  PC817  [DIP-4]
U17  PC817  [DIP-4]

### Nets
+5V: P49.1 P49.2
+5V_DO: C50.1 P50.1 P50.2 R74.2 R75.2 R76.2 R77.2 R78.2 R79.2 U13.20(VCC)
VSS: P49.3 P49.4 P49.5 P49.6 P49.7 P49.8 P49.9 P49.10
VSS_DO: C50.2 P50.3 P50.4 P50.5 P50.6 P50.7 P50.8 P50.9 P50.10 U13.10(GND)
DATA0: P47.1
DATA1: P47.2
DATA2: P47.3
DATA3: P47.4
DATA4: P47.5
DATA5: P47.6
DATA6: P47.7
DATA7: P47.8
DO_DATA0: P45.1 U13.3(D1)
DO_DATA1: P45.2 U13.4(D2)
DO_DATA2: P45.3 U13.7(D3)
DO_DATA3: P45.4 U13.8(D4)
DO_DATA4: P45.5 U13.13(D5)
DO_DATA5: P45.6 U13.14(D6)
DO_DATA6: P45.7 U13.17(D7)
DO_DATA7: P45.8 U13.18(D8)
DO_DOUT_CLK: P45.9 U13.11(CLK)
DO_OUTPUT_ENABLE: P45.10 U13.1(~{OE})
DOUT_CLK: P47.9
OUTPUT_ENABLE: P47.10
NetP41_1: P41.1 Q1.2(C) Q1.4(C) U11.4(C)
NetP41_2: P41.2 Q1.3(E)
NetP42_1: P42.1 Q2.2(C) Q2.4(C) U12.4(C)
NetP42_2: P42.2 Q2.3(E)
NetP43_1: P43.1 Q3.2(C) Q3.4(C) U14.4(C)
NetP43_2: P43.2 Q3.3(E)
NetP44_1: P44.1 Q4.2(C) Q4.4(C) U15.4(C)
NetP44_2: P44.2 Q4.3(E)
NetP46_1: P46.1 Q5.2(C) Q5.4(C) U16.4(C)
NetP46_2: P46.2 Q5.3(E)
NetP48_1: P48.1 Q6.2(C) Q6.4(C) U17.4(C)
NetP48_2: P48.2 Q6.3(E)
NetQ1_1: Q1.1(B) U11.3(E)
NetQ2_1: Q2.1(B) U12.3(E)
NetQ3_1: Q3.1(B) U14.3(E)
NetQ4_1: Q4.1(B) U15.3(E)
NetQ5_1: Q5.1(B) U16.3(E)
NetQ6_1: Q6.1(B) U17.3(E)
NetR74_1: R74.1 U11.1(A)
NetR75_1: R75.1 U12.1(A)
NetR76_1: R76.1 U14.1(A)
NetR77_1: R77.1 U15.1(A)
NetR78_1: R78.1 U16.1(A)
NetR79_1: R79.1 U17.1(A)
NetU11_2: U11.2(K) U13.2(Q1)
NetU12_2: U12.2(K) U13.5(Q2)
NetU13_6: U13.6(Q3) U14.2(K)
NetU13_9: U13.9(Q4) U15.2(K)
NetU13_12: U13.12(Q5) U16.2(K)
NetU13_15: U13.15(Q6) U17.2(K)

Not connected (* = marked no-connect by the designer): U13 16(Q7) 19(Q8)

### Notes on the sheet
- (near P41) Out
- (near P41) +24Vdc
- (near P42) +24Vdc
- (near P42) Out
- (near P43) Out
- (near P43) +24Vdc
- (near P44) Out
- (near P44) +24Vdc
- (near P46) Out
- (near P46) +24Vdc
- (near P48) Out
- (near P48) +24Vdc
- Title
- Size:
- Date:
- A4
- Number:
- Time:
- Revision:
- Sheet
- of
- File:
- (in symbol BCP56) 2, 4

### Library data of the parts
C50 = C1206: Ceramic Chip Capacitor - Standard; Published: 17-Jul-2002; LatestRevisionDate: 19-Mar-2004; LatestRevisionNote: Silkscreen size reduced.; DatasheetDocument: Mar-2001; PackageDocument: Mar-2001; PackageReference: 1206; Publisher: Altium Limited; Code_JEITA: 1206; Code_IPC: 3216 [1206]; ComponentLink1Description: Manufacturer Link; ComponentLink1URL: http://www.kemet.com/; ComponentLink2Description: Datasheet; ComponentLink2URL: http://www.kemet.com/kemet/web/homepage/kechome.nsf/vapubfilesname/F3102TA.pdf/$file/F3102TA.pdf
P41-P44 P46 P48 = Terminal blok 2 pina: Terminal blok 2
P45 P47 P49 P50 = Header 5X2: Header, 5-Pin, Dual row; LatestRevisionDate: 17-Jul-2002; LatestRevisionNote: Re-released for DXP Platform.; Publisher: Altium Limited
Q1-Q6 = BCP56: NPN Medium Power Transistor; Published: 17-Sep-2003; LatestRevisionDate: 12-Dec-2006; LatestRevisionNote: IPC-7351 Footprint Added.; DatasheetVersion: 10-Oct-2001; PackageVersion: Aug-2001; PackageReference: SOT223; Publisher: Altium Limited; PackageDescription: 4-Pin SOT-223 Package 2.3 mm Pitch, 7 mm Lead Span; ComponentLink1Description: Manufacturer Link; ComponentLink1URL: http://www.semiconductors.philips.com/; ComponentLink2Description: Datasheet; ComponentLink2URL: http://www.semiconductors.philips.com/acrobat/datasheets/BC639_BCP56_BCX56_7.pdf
R74-R79 = ERAS: as R125 on sheet CuC_PSU; Published: 17-Dec-2003; LatestRevisionDate: 19-Mar-2004; LatestRevisionNote: Silkscreen size reduced.; PackageDocument: Mar-2003; PackageReference: ERA-0805; Publisher: Altium Limited; Code_IPC: 2012 [0805]; ComponentLink1Description: Manufacturer Link; ComponentLink1URL: http://www.panasonic.com/industrial/components/resistive_products.htm; ComponentLink2Description: Datasheet; ComponentLink2URL: http://www.panasonic.com/industrial/components/pdf/AOF0000CE1.pdf
U11 U12 U14-U17 = Optoisolator1: 4-Pin Phototransistor Optocoupler; Published: 24-Mar-1999; LatestRevisionDate: 04-Mar-2005; LatestRevisionNote: Sch pins 3 & 4 Swapped.; DatasheetVersion: Nov-2003; PackageReference: DIP-4; Publisher: Altium Limited
U13 = SN74ALS374N: Octal D-Type Edge-Triggered Flip-Flop with 3-State Outputs; Published: 8-Jun-2000; LatestRevisionDate: 04-Mar-2005; LatestRevisionNote: Stylized 3D Model Added.; DatasheetVersion: May-1986; PackageVersion: Oct-1995; PackageReference: N020D; Publisher: Altium Limited; PackageDescription: DIP; 20 Leads; Row Spacing 7.62 mm; Pitch 2.54 mm; ComponentLink1Description: Manufacturer Link; ComponentLink1URL: http://www.ti.com/

## Sheet RelayOutput.SchDoc: Relay output
size A3; Author: eldar6776@hotmail.com; DrawnBy: Eldar Dedić; Organization: PROVEN d.o.o.; Address1: Adema Buće 102; Address2: 71000 Sarajevo; Address3: Federacija BiH; Address4: Bosna i Hercegovina; DocumentNumber: DE211213; Revision: 001; SheetNumber: 5; SheetTotal: 15; ProjectName: MIKSER SIROVINE
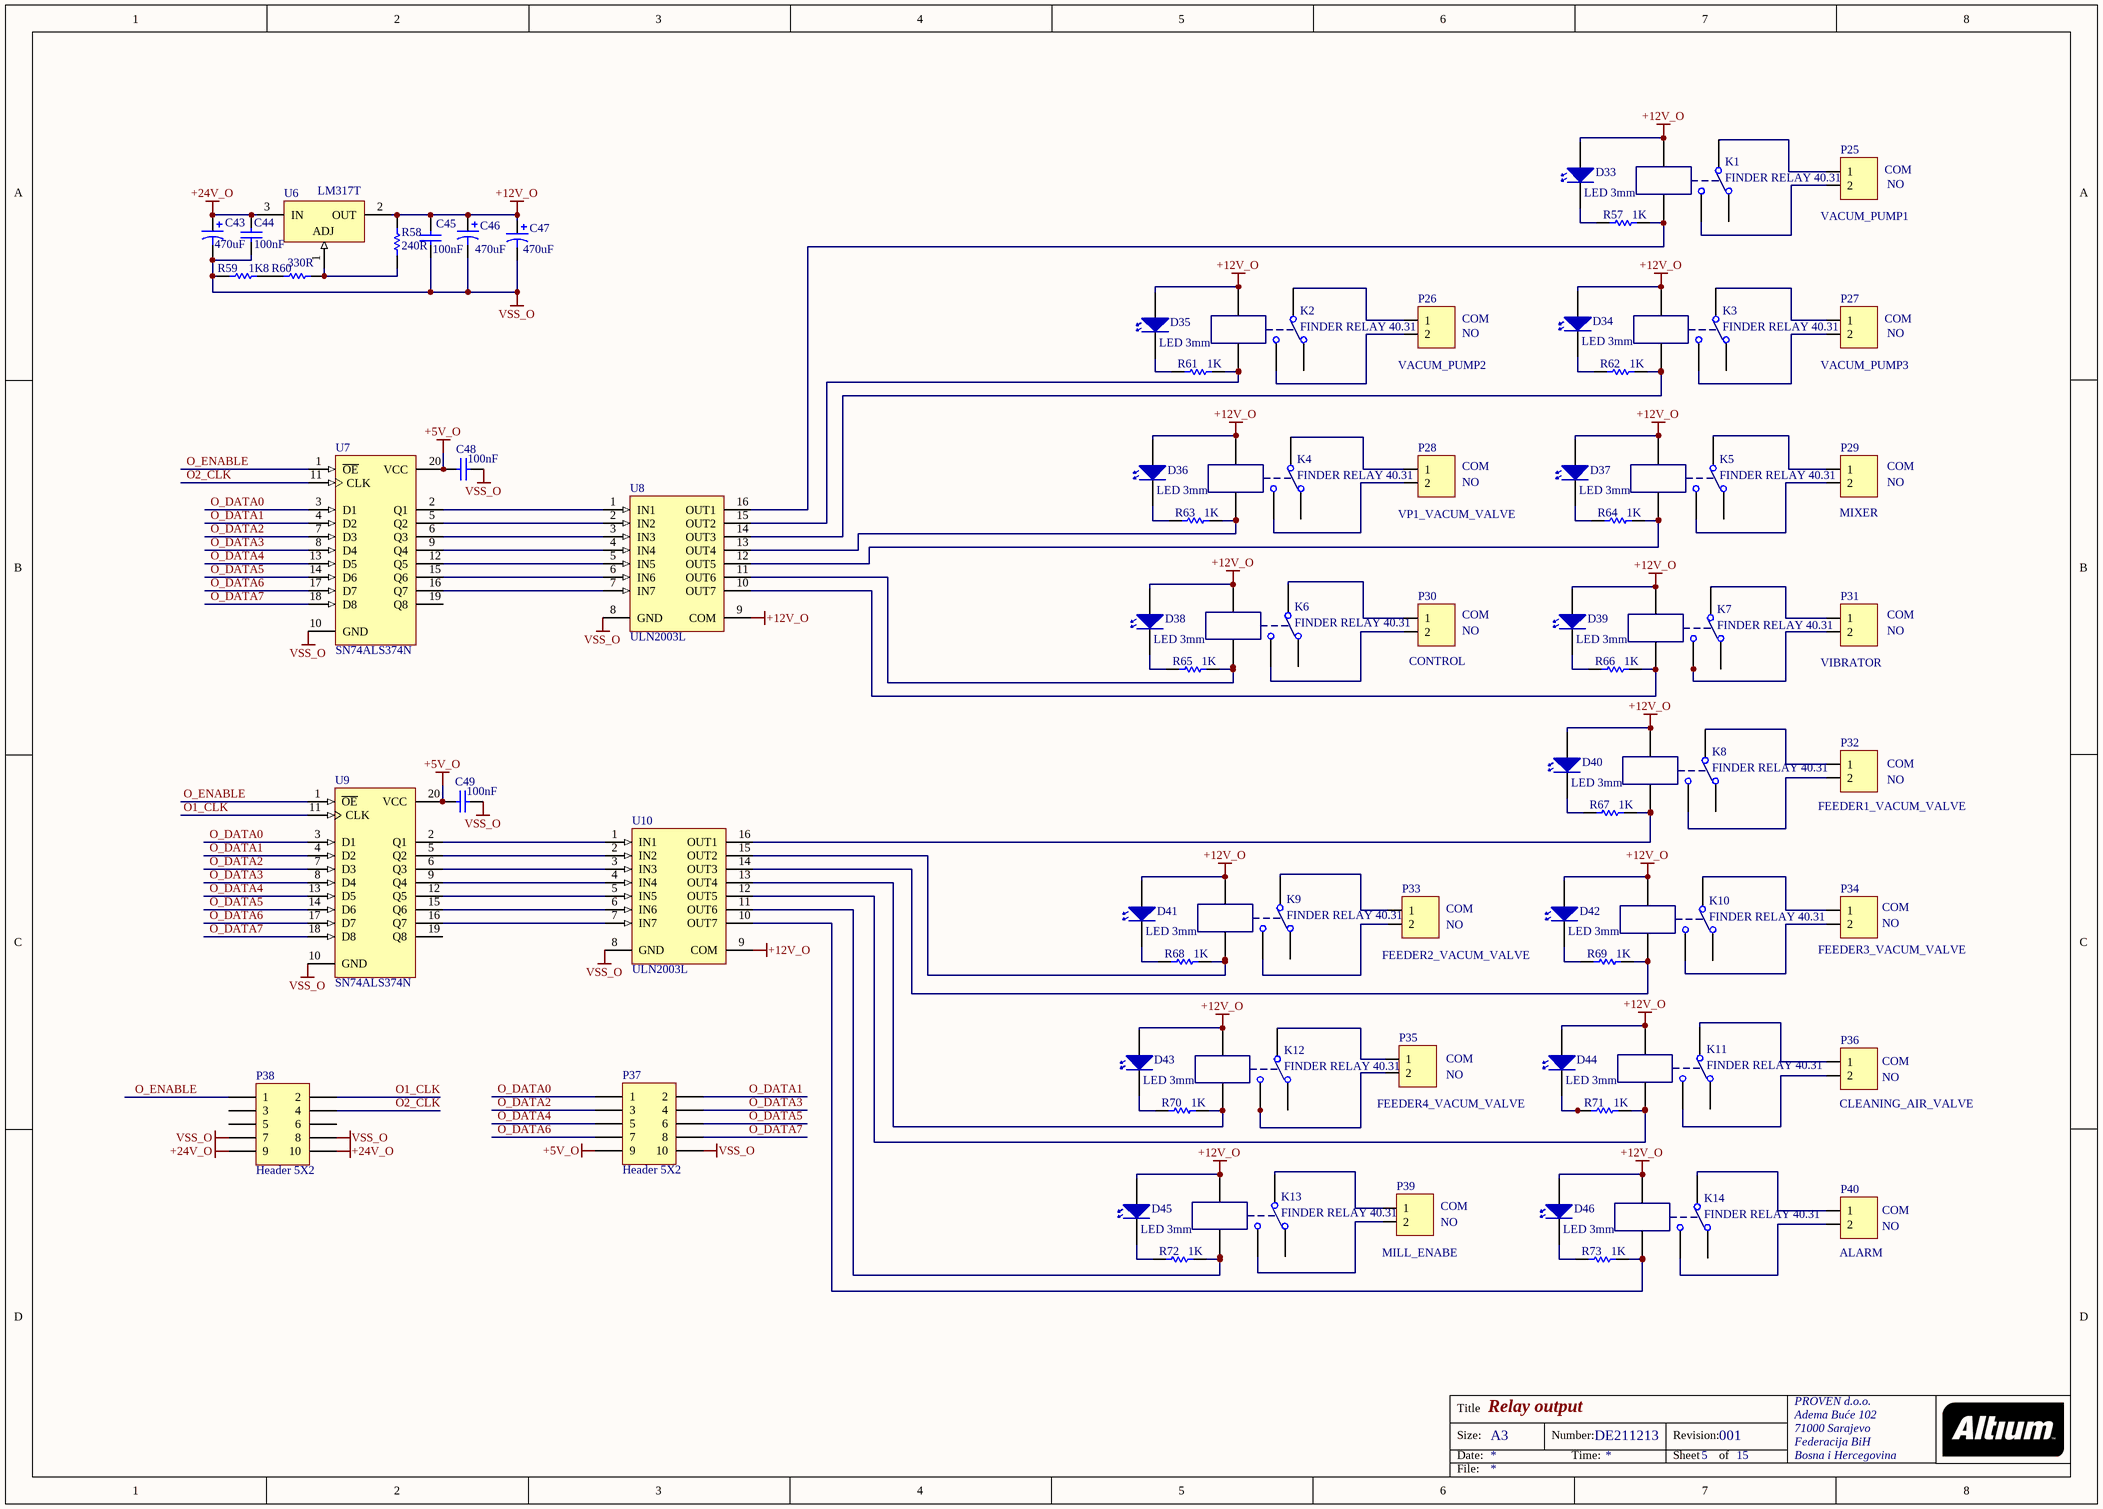
[diagram p4: RelayOutput.SchDoc]

### Parts
C43  470uF  [CAPPR5-10X16]
C44  value 100nF  [1206]
C45  value 100nF  [1206]
C46  470uF  [CAPPR5-10X16]
C47  470uF  [CAPPR5-10X16]
C48  value 100nF  [1206]
C49  value 100nF  [1206]
D33  LED 3mm  [LED 3mm]
D34  LED 3mm  [LED 3mm]
D35  LED 3mm  [LED 3mm]
D36  LED 3mm  [LED 3mm]
D37  LED 3mm  [LED 3mm]
D38  LED 3mm  [LED 3mm]
D39  LED 3mm  [LED 3mm]
D40  LED 3mm  [LED 3mm]
D41  LED 3mm  [LED 3mm]
D42  LED 3mm  [LED 3mm]
D43  LED 3mm  [LED 3mm]
D44  LED 3mm  [LED 3mm]
D45  LED 3mm  [LED 3mm]
D46  LED 3mm  [LED 3mm]
K1  FINDER RELAY 40.31  [FINDER 40.31]
K2  FINDER RELAY 40.31  [FINDER 40.31]
K3  FINDER RELAY 40.31  [FINDER 40.31]
K4  FINDER RELAY 40.31  [FINDER 40.31]
K5  FINDER RELAY 40.31  [FINDER 40.31]
K6  FINDER RELAY 40.31  [FINDER 40.31]
K7  FINDER RELAY 40.31  [FINDER 40.31]
K8  FINDER RELAY 40.31  [FINDER 40.31]
K9  FINDER RELAY 40.31  [FINDER 40.31]
K10  FINDER RELAY 40.31  [FINDER 40.31]
K11  FINDER RELAY 40.31  [FINDER 40.31]
K12  FINDER RELAY 40.31  [FINDER 40.31]
K13  FINDER RELAY 40.31  [FINDER 40.31]
K14  FINDER RELAY 40.31  [FINDER 40.31]
P25  VACUM_PUMP1  [TERMINAL BLOK 2]
P26  VACUM_PUMP2  [TERMINAL BLOK 2]
P27  VACUM_PUMP3  [TERMINAL BLOK 2]
P28  VP1_VACUM_VALVE  [TERMINAL BLOK 2]
P29  MIXER  [TERMINAL BLOK 2]
P30  CONTROL  [TERMINAL BLOK 2]
P31  VIBRATOR  [TERMINAL BLOK 2]
P32  FEEDER1_VACUM_VALVE  [TERMINAL BLOK 2]
P33  FEEDER2_VACUM_VALVE  [TERMINAL BLOK 2]
P34  FEEDER3_VACUM_VALVE  [TERMINAL BLOK 2]
P35  FEEDER4_VACUM_VALVE  [TERMINAL BLOK 2]
P36  CLEANING_AIR_VALVE  [TERMINAL BLOK 2]
P37  Header 5X2  [HDR2X5]
P38  Header 5X2  [HDR2X5]
P39  MILL_ENABE  [TERMINAL BLOK 2]
P40  ALARM  [TERMINAL BLOK 2]
R57  1K  [ERA-0805]
R58  240R  [ERA-0805]
R59  1K8  [ERA-0805]
R60  330R  [ERA-0805]
R61  1K  [ERA-0805]
R62  1K  [ERA-0805]
R63  1K  [ERA-0805]
R64  1K  [ERA-0805]
R65  1K  [ERA-0805]
R66  1K  [ERA-0805]
R67  1K  [ERA-0805]
R68  1K  [ERA-0805]
R69  1K  [ERA-0805]
R70  1K  [ERA-0805]
R71  1K  [ERA-0805]
R72  1K  [ERA-0805]
R73  1K  [ERA-0805]
U6  LM317T  [221A-04]
U7  SN74ALS374N  [N020D]
U8  ULN2003L  [L16_N]
U9  SN74ALS374N  [N020D]
U10  ULN2003L  [L16_N]

### Nets
+5V_O: C48.1 C49.1 P37.9 U7.20(VCC) U9.20(VCC)
+12V_O: C45.2 C46.1 C47.1 D33.2 D34.2 D35.2 D36.2 D37.2 D38.2 D39.2 D40.2 D41.2 D42.2 D43.2 D44.2 D45.2 D46.2 K1.1 K2.1 K3.1 K4.1 K5.1 K6.1 K7.1 K8.1 K9.1 K10.1 K11.1 K12.1 K13.1 K14.1 R58.2 U6.2(OUT) U8.9(COM) U10.9(COM)
+24V_O: C43.1 C44.2 P38.9 P38.10 U6.3(IN)
VSS_O: C43.2 C44.1 C45.1 C46.2 C47.2 C48.2 C49.2 P37.10 P38.7 P38.8 R59.2 U7.10(GND) U8.8(GND) U9.10(GND) U10.8(GND)
O1_CLK: P38.2 U9.11(CLK)
O2_CLK: P38.4 U7.11(CLK)
O_DATA0: P37.1 U7.3(D1) U9.3(D1)
O_DATA1: P37.2 U7.4(D2) U9.4(D2)
O_DATA2: P37.3 U7.7(D3) U9.7(D3)
O_DATA3: P37.4 U7.8(D4) U9.8(D4)
O_DATA4: P37.5 U7.13(D5) U9.13(D5)
O_DATA5: P37.6 U7.14(D6) U9.14(D6)
O_DATA6: P37.7 U7.17(D7) U9.17(D7)
O_DATA7: P37.8 U7.18(D8) U9.18(D8)
O_ENABLE: P38.1 U7.1(~{OE}) U9.1(~{OE})
NetD33_1: D33.1 R57.1
NetD34_1: D34.1 R62.1
NetD35_1: D35.1 R61.1
NetD36_1: D36.1 R63.1
NetD37_1: D37.1 R64.1
NetD38_1: D38.1 R65.1
NetD39_1: D39.1 R66.1
NetD40_1: D40.1 R67.1
NetD41_1: D41.1 R68.1
NetD42_1: D42.1 R69.1
NetD43_1: D43.1 R70.1
NetD44_1: D44.1 R71.1
NetD45_1: D45.1 R72.1
NetD46_1: D46.1 R73.1
NetK1_2: K1.2 R57.2 U8.16(OUT1)
NetK1_3: K1.3 P25.1
NetK1_4: K1.4 P25.2
NetK2_2: K2.2 R61.2 U8.15(OUT2)
NetK2_3: K2.3 P26.1
NetK2_4: K2.4 P26.2
NetK3_2: K3.2 R62.2 U8.14(OUT3)
NetK3_3: K3.3 P27.1
NetK3_4: K3.4 P27.2
NetK4_2: K4.2 R63.2 U8.13(OUT4)
NetK4_3: K4.3 P28.1
NetK4_4: K4.4 P28.2
NetK5_2: K5.2 R64.2 U8.12(OUT5)
NetK5_3: K5.3 P29.1
NetK5_4: K5.4 P29.2
NetK6_2: K6.2 R65.2 U8.11(OUT6)
NetK6_3: K6.3 P30.1
NetK6_4: K6.4 P30.2
NetK7_2: K7.2 R66.2 U8.10(OUT7)
NetK7_3: K7.3 P31.1
NetK7_4: K7.4 P31.2
NetK8_2: K8.2 R67.2 U10.16(OUT1)
NetK8_3: K8.3 P32.1
NetK8_4: K8.4 P32.2
NetK9_2: K9.2 R68.2 U10.15(OUT2)
NetK9_3: K9.3 P33.1
NetK9_4: K9.4 P33.2
NetK10_2: K10.2 R69.2 U10.14(OUT3)
NetK10_3: K10.3 P34.1
NetK10_4: K10.4 P34.2
NetK11_2: K11.2 R71.2 U10.12(OUT5)
NetK11_3: K11.3 P36.1
NetK11_4: K11.4 P36.2
NetK12_2: K12.2 R70.2 U10.13(OUT4)
NetK12_3: K12.3 P35.1
NetK12_4: K12.4 P35.2
NetK13_2: K13.2 R72.2 U10.11(OUT6)
NetK13_3: K13.3 P39.1
NetK13_4: K13.4 P39.2
NetK14_2: K14.2 R73.2 U10.10(OUT7)
NetK14_3: K14.3 P40.1
NetK14_4: K14.4 P40.2
NetR58_1: R58.1 R60.1 U6.1(ADJ)
NetR59_1: R59.1 R60.2
NetU7_2: U7.2(Q1) U8.1(IN1)
NetU7_5: U7.5(Q2) U8.2(IN2)
NetU7_6: U7.6(Q3) U8.3(IN3)
NetU7_9: U7.9(Q4) U8.4(IN4)
NetU7_12: U7.12(Q5) U8.5(IN5)
NetU7_15: U7.15(Q6) U8.6(IN6)
NetU7_16: U7.16(Q7) U8.7(IN7)
NetU9_2: U9.2(Q1) U10.1(IN1)
NetU9_5: U9.5(Q2) U10.2(IN2)
NetU9_6: U9.6(Q3) U10.3(IN3)
NetU9_9: U9.9(Q4) U10.4(IN4)
NetU9_12: U9.12(Q5) U10.5(IN5)
NetU9_15: U9.15(Q6) U10.6(IN6)
NetU9_16: U9.16(Q7) U10.7(IN7)

Not connected (* = marked no-connect by the designer): K1 5; K2 5; K3 5; K4 5; K5 5; K6 5; K7 5; K8 5; K9 5; K10 5; K11 5; K12 5; K13 5; K14 5; P38 3 5 6; U7 19(Q8); U9 19(Q8)

### Notes on the sheet
- (near P25) COM
- (near P25) NO
- (near P26) NO
- (near P26) COM
- (near P27) COM
- (near P27) NO
- (near P28) COM
- (near P28) NO
- (near P29) COM
- (near P29) NO
- (near P30) COM
- (near P30) NO
- (near P31) COM
- (near P31) NO
- (near P32) COM
- (near P32) NO
- (near P33) COM
- (near P34) COM
- (near P33) NO
- (near P34) NO
- (near P35) COM
- (near P35) NO
- (near P36) COM
- (near P36) NO
- (near P39) COM
- (near P39) NO
- (near P40) COM
- (near P40) NO
- Title
- Size:
- Date:
- A3
- Number:
- Time:
- Revision:
- Sheet
- of
- File:

### Library data of the parts
C43 C46 C47 = EKA00DD347F00: as C62 on sheet CuC_PSU; Published: 19-Mar-2004; DatasheetDocument: 20-Feb-2001; PackageReference: CAPPR5-10X16; Publisher: Altium Limited; ComponentLink1Description: Manufacturer Link; ComponentLink1URL: http://www.vishay.com/; ComponentLink2Description: Datasheet; ComponentLink2URL: http://www.vishay.com/docs/25014/eka.pdf; Value: 470uF
C44 C45 C48 C49 = C1206: Ceramic Chip Capacitor - Standard; Published: 17-Jul-2002; LatestRevisionDate: 19-Mar-2004; LatestRevisionNote: Silkscreen size reduced.; DatasheetDocument: Mar-2001; PackageDocument: Mar-2001; PackageReference: 1206; Publisher: Altium Limited; Code_JEITA: 1206; Code_IPC: 3216 [1206]; ComponentLink1Description: Manufacturer Link; ComponentLink1URL: http://www.kemet.com/; ComponentLink2Description: Datasheet; ComponentLink2URL: http://www.kemet.com/kemet/web/homepage/kechome.nsf/vapubfilesname/F3102TA.pdf/$file/F3102TA.pdf
P25-P36 P39 P40 = Terminal blok 2 pina: Terminal blok 2
P37 P38 = Header 5X2: Header, 5-Pin, Dual row; LatestRevisionDate: 17-Jul-2002; LatestRevisionNote: Re-released for DXP Platform.; Publisher: Altium Limited
R57-R73 = ERAS: as R125 on sheet CuC_PSU; Published: 17-Dec-2003; LatestRevisionDate: 19-Mar-2004; LatestRevisionNote: Silkscreen size reduced.; PackageDocument: Mar-2003; PackageReference: ERA-0805; Publisher: Altium Limited; Code_IPC: 2012 [0805]; ComponentLink1Description: Manufacturer Link; ComponentLink1URL: http://www.panasonic.com/industrial/components/resistive_products.htm; ComponentLink2Description: Datasheet; ComponentLink2URL: http://www.panasonic.com/industrial/components/pdf/AOF0000CE1.pdf
U6 = LM317T: as U24 on sheet CuC_PSU; Published: 17-Jul-2002; DatasheetVersion: 1988; PackageReference: 221A-04; Publisher: Altium Limited; PackageDescription: TO, Thru-Hole, Vertical, Heatsink Mounted; 3 In-Line Leads; Pitch 2.54 mm; Code_JEDEC: TO-262-AA; ComponentLink1Description: Manufacturer Link; ComponentLink1URL: http://www.onsemi.com/site/products/taxonomy/0,4438,503,00.html; ComponentLink2Description: Datasheet; ComponentLink2URL: http://www.onsemi.com/pub/Collateral/LM317-D.PDF
U7 U9 = SN74ALS374N: as U13 on sheet DigitalOutput; Published: 8-Jun-2000; LatestRevisionDate: 04-Mar-2005; LatestRevisionNote: Stylized 3D Model Added.; DatasheetVersion: May-1986; PackageVersion: Oct-1995; PackageReference: N020D; Publisher: Altium Limited; PackageDescription: DIP; 20 Leads; Row Spacing 7.62 mm; Pitch 2.54 mm; ComponentLink1Description: Manufacturer Link; ComponentLink1URL: http://www.ti.com/
U8 U10 = ULN2003L: High-Voltage, High-Current Darlington Array; Published: 13-Oct-2000; LatestRevisionDate: 13-Apr-2006; LatestRevisionNote: IPC-7351 Footprint Added.; DatasheetVersion: 1998; PackageReference: L16; Publisher: Altium Limited; PackageDescription: 16-Pin Small Outline Integrated Circuit 1.27 mm Pitch; Code_JEDEC: MS-012-AC; Code_IPC: SOIC127P600-16; ComponentLink1Description: Manufacturer Link; ComponentLink1URL: http://www.allegromicro.com/